# Altium schematic sheet Main.SchDoc
size A4
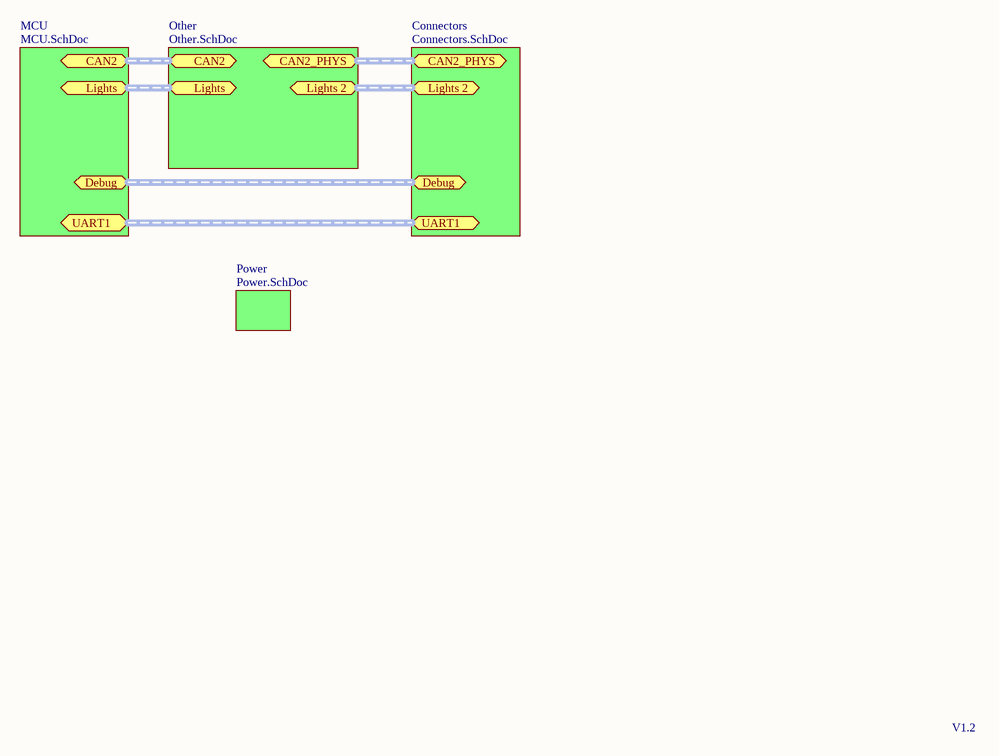
[diagram p0: Main.SchDoc]

## Sub-sheets
Connectors = Connectors.SchDoc: no entries
MCU = MCU.SchDoc: no entries
Other = Other.SchDoc: no entries
Power = Power.SchDoc: no entries

## Ports
CAN2 (harness CAN), CAN2_PHYS (harness CAN_PHYS), Debug (harness Debug), Lights 2 (harness Light Control Signals), Lights (harness Light Control Signals), UART1 (harness UART)

## Notes on the sheet
- V1.2